# Altium schematic sheet PineconePiWatch-Bottom.SchDoc
size A2
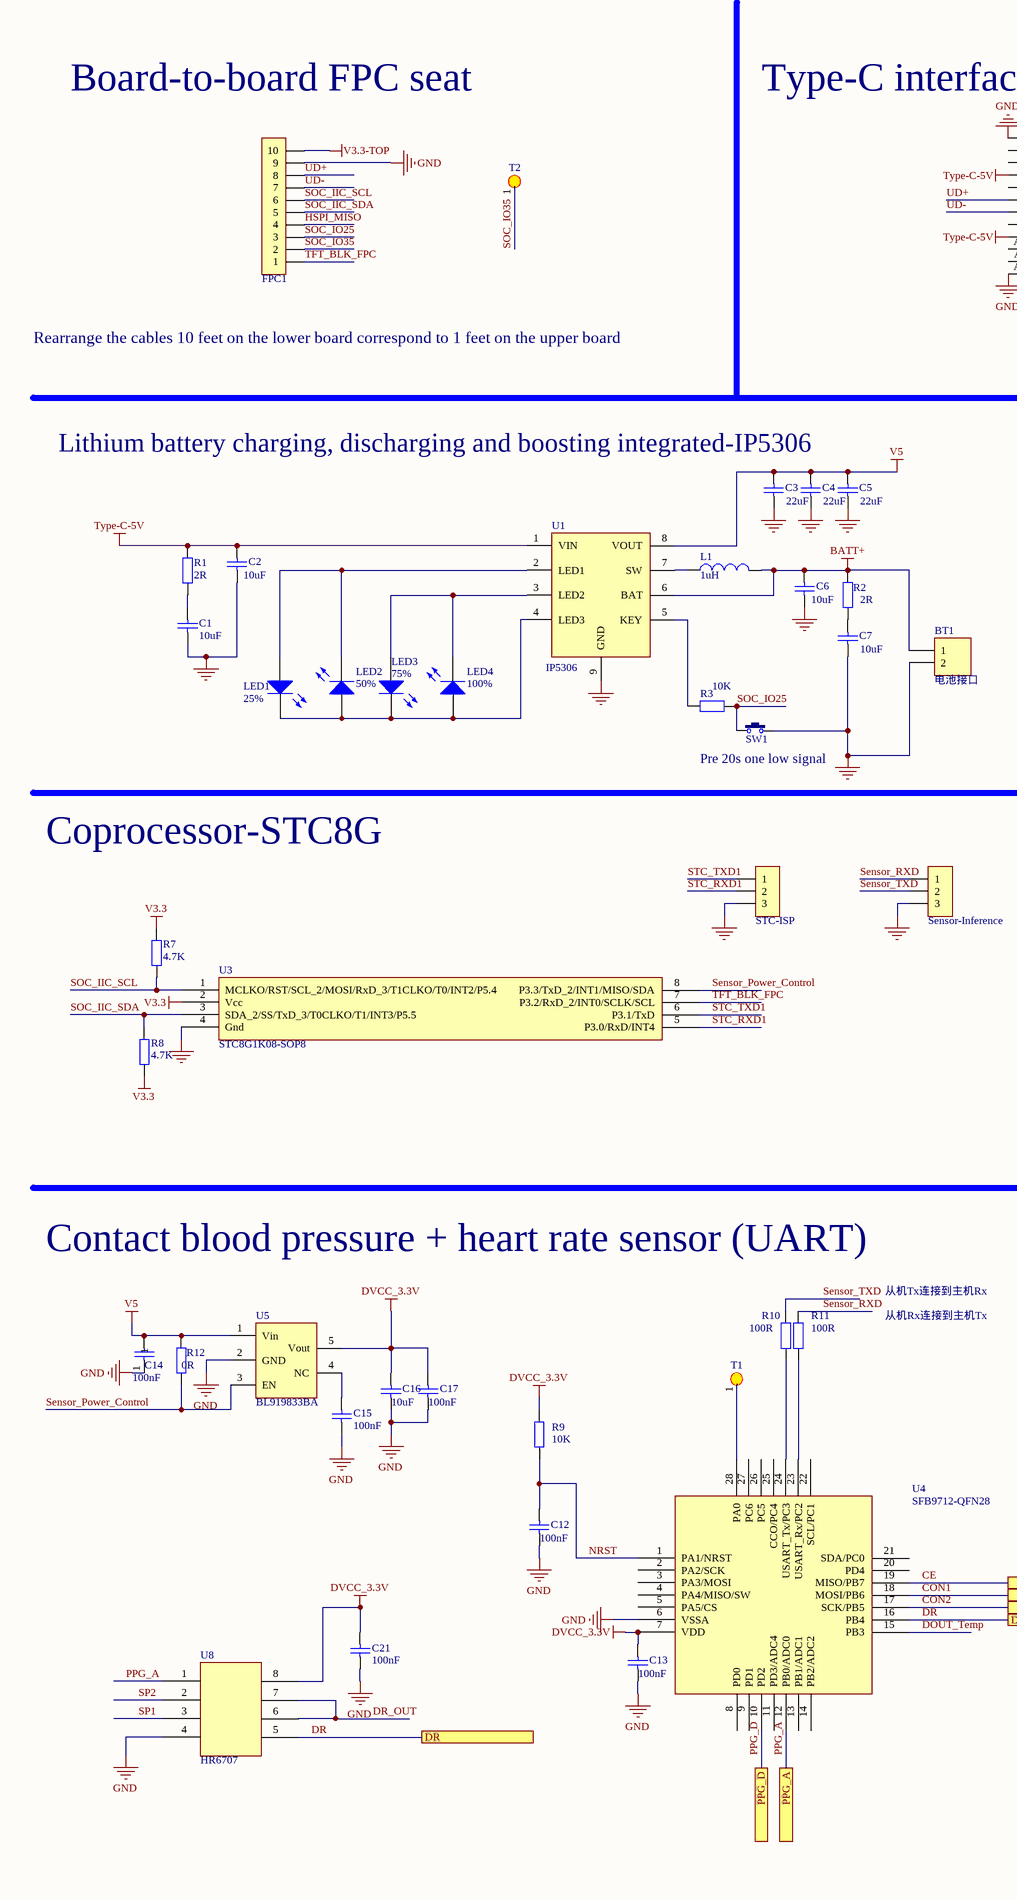
[diagram p0: PineconePiWatch-Bottom.SchDoc, left]
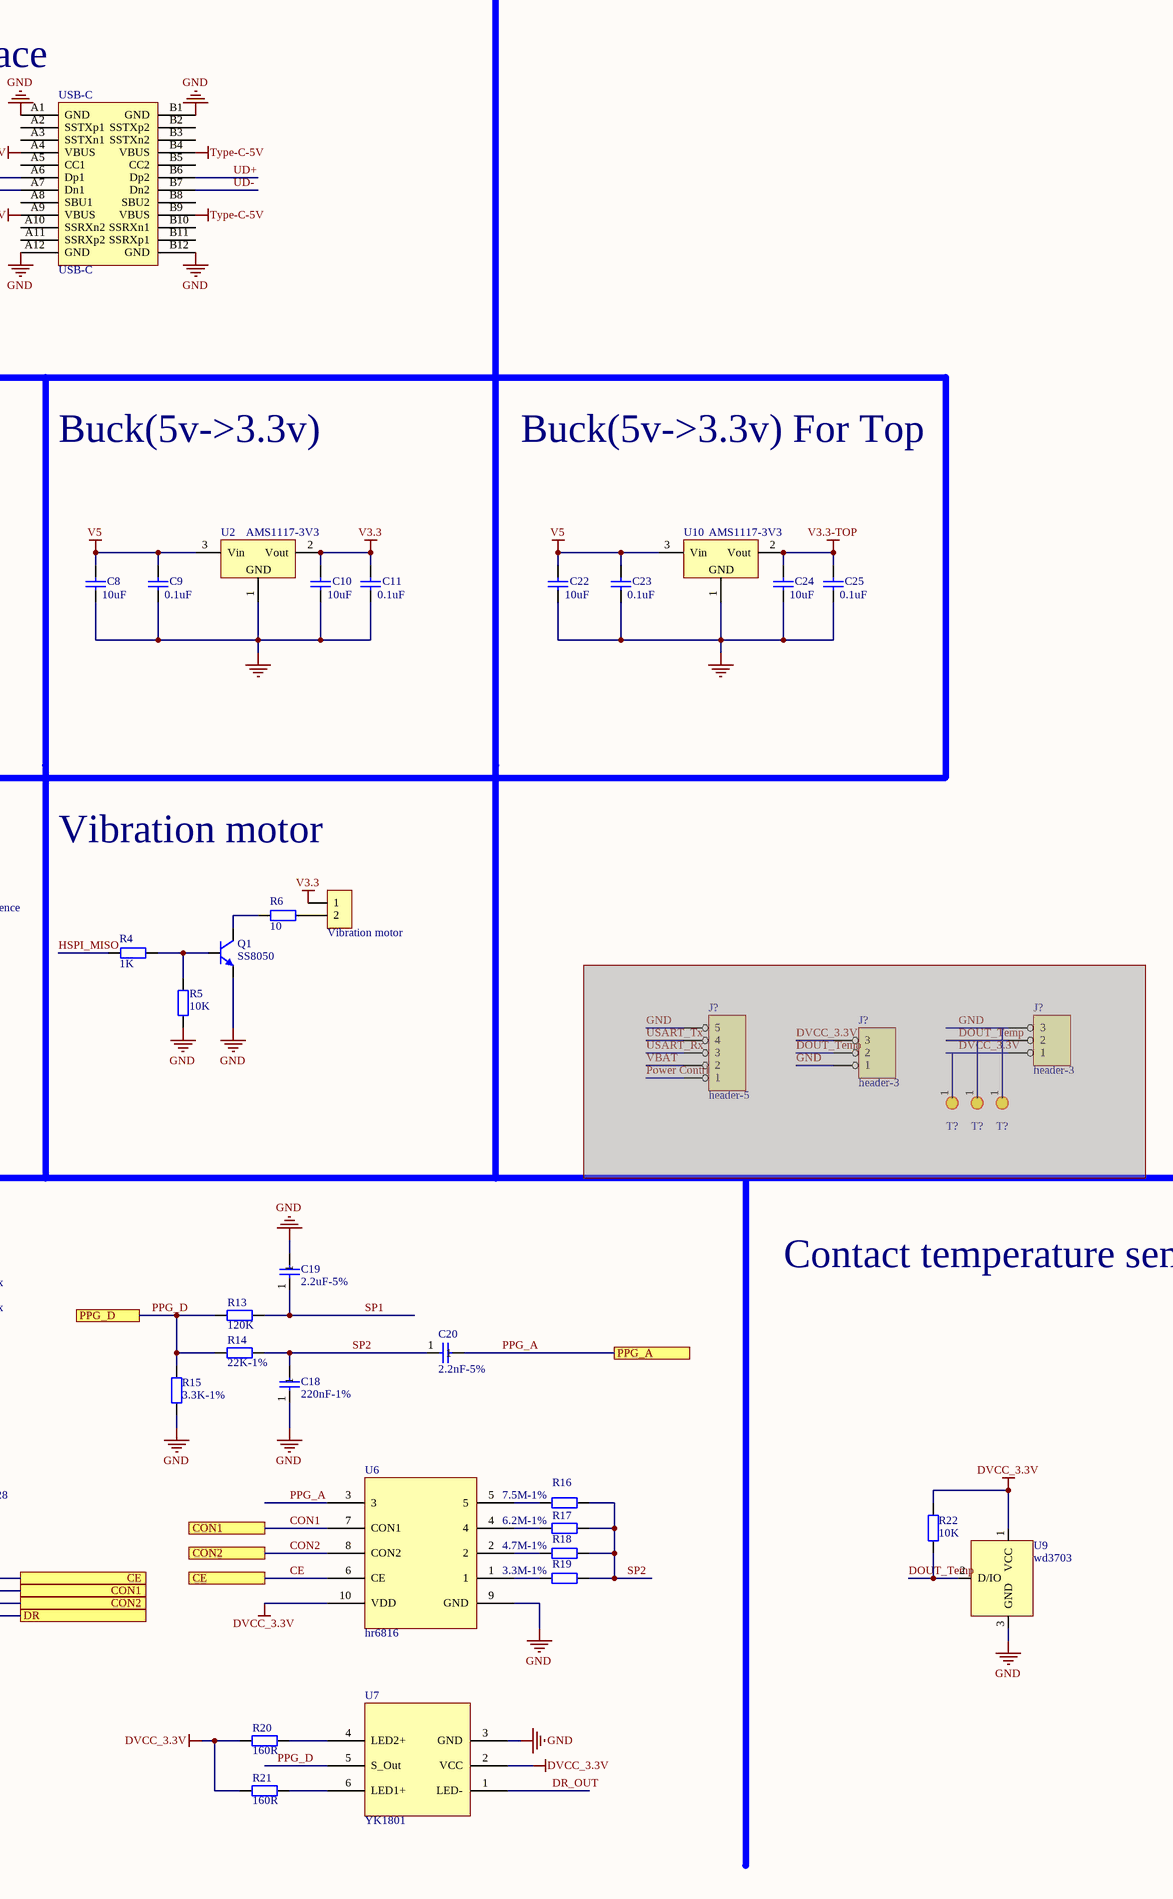
[diagram p1: PineconePiWatch-Bottom.SchDoc, right]

## Parts
(Parts that share a designator on the sheet are numbered #1, #2 ... from top to bottom, then left to right.)
BT1  电池接口  [XH2.54-LI-2P]
C1  10uF  [C 0603_L]
C2  10uF  [C 0603_L]
C3  22uF  [C 0603_L]
C4  22uF  [C 0603_L]
C5  22uF  [C 0603_L]
C6  10uF  [C 0603_L]
C7  10uF  [C 0603_L]
C8  10uF  [C 0603_L]
C9  0.1uF  [C 0603_L]
C10  10uF  [C 0603_L]
C11  0.1uF  [C 0603_L]
C12  100nF  [C 0603_L]
C13  100nF  [C 0603_L]
C14  100nF  [C 0603_L]
C15  100nF  [C 0603_L]
C16  10uF  [C 0603_L]
C17  100nF  [C 0603_L]
C18  value 220nF-1%  [C 0603_L]  (hidden comment: 220nF)
C19  value 2.2uF-5%  [C 0603_L]  (hidden comment: 2.2uF)
C20  value 2.2nF-5%  [C 0603_L]  (hidden comment: 2.2nF)
C21  100nF  [C 0603_L]
C22  10uF  [C 0603_L]
C23  0.1uF  [C 0603_L]
C24  10uF  [C 0603_L]
C25  0.1uF  [C 0603_L]
FPC1  HDR-1X10  [FPC1.0-2H-WS-10P]  (value not drawn)
J?#1  header-3  [header-3]  (masked out: inside a compile mask, not in the netlist)
J?#2  header-3  [header-3]  (masked out: inside a compile mask, not in the netlist)
J?#3  header-5  [CON5]  (masked out: inside a compile mask, not in the netlist)
L1  1uH  [L-SMD-0630]
LED1  25%  [LED 0603R]
LED2  50%  [LED 0603R]
LED3  75%  [LED 0603R]
LED4  100%  [LED 0603R]
Q1  SS8050  [SOT-23]
R1  2R  [R 0603_L]
R2  2R  [R 0603_L]
R3  10K  [R 0603_L]
R4  1K  [R 0603_L]
R5  10K  [R 0603_L]
R6  10  [R 0603_L]
R7  4.7K  [R 0603_L]
R8  4.7K  [R 0603_L]
R9  10K  [R 0603_L]
R10  100R  [C 0603_L]
R11  100R  [C 0603_L]
R12  value 0R  [R 0603-HP_L]  (hidden comment: 0)
R13  120K  [R 0603_L]
R14  value 22K-1%  [R 0603_L]  (hidden comment: 22K)
R15  value 3.3K-1%  [R 0603_L]  (hidden comment: 3.3K)
R16  value 7.5M-1%  [R 0603_L]  (hidden comment: 7.5M)
R17  value 6.2M-1%  [R 0603_L]  (hidden comment: 6.2M)
R18  value 4.7M-1%  [R 0603_L]  (hidden comment: 4.7M)
R19  value 3.3M-1%  [R 0603_L]  (hidden comment: 3.3M)
R20  160R  [R 0603_L]
R21  160R  [R 0603_L]
R22  10K  [R 0603_L]
Sensor-Inference  HDR-1X3  [HDR2.54-LI-3P]  (value not drawn)
STC-ISP  HDR-1X3  [HDR2.54-LI-3P]  (value not drawn)
SW1  3x6x5  [TSW 3*6*4.3-S-W]  (value not drawn)
T1  Test_Point  [TP_1_0MM]  (value not drawn)
T2  Test_Point  [TP_1_0MM]  (value not drawn)
T?#1  Test_Point  [TP_1_0MM]  (value not drawn)  (masked out: inside a compile mask, not in the netlist)
T?#2  Test_Point  [TP_1_0MM]  (value not drawn)  (masked out: inside a compile mask, not in the netlist)
T?#3  Test_Point  [TP_1_0MM]  (value not drawn)  (masked out: inside a compile mask, not in the netlist)
U1  IP5306  [IP5306]
U2  AMS1117-3V3  [SOT223_L]
U3  STC8G1K08-SOP8  [SOP8]
U4  SFB9712-QFN28  [SFB9712]
U5  BL919833BA  [BL9198]
U6  hr6816  [HR6816]
U7  YK1801  [YK1801]
U8  HR6707  [HR6707]
U9  wd3703  [WD3703]
U10  AMS1117-3V3  [SOT223_L]
USB-C  USB-C  [type-c 24p 前插后贴]
Vibration_motor  HDR-1X2  [HDR2.54-LI-2P]  (value not drawn)

## Ports
CE, CON1, CON2, DR, PPG_A, PPG_D

## Nets
BATT+: BT1.1 C6.2 L1.2 R2.1 U1.6(BAT)
DVCC_3.3V: C13.2 C16.2 C17.2 C21.2 R9.1 R20.1 R21.1 R22.2 U4.7(VDD) U5.5(Vout) U6.10(VDD) U7.2(VCC) U8.8 U9.1(VCC)
GND: BT1.2 C1.1 C2.1 C3.1 C4.1 C5.1 C6.1 C7.1 C8.1 C9.1 C10.1 C11.1 C12.1 C13.1 C14.1 C15.1 C16.1 C17.1 C18.1 C19.2 C21.1 C22.1 C23.1 C24.1 C25.1 FPC1.9 Q1.2(E) R5.1 R15.1 Sensor-Inference.3 STC-ISP.3 SW1.2 U1.9(GND) U2.1(GND) U3.4(Gnd) U4.6(VSSA) U5.2(GND) U6.9(GND) U7.3(GND) U8.4 U9.3(GND) U10.1(GND) USB-C.A1(GND) USB-C.A12(GND) USB-C.B1(GND) USB-C.B12(GND)
Type-C-5V: C2.2 R1.2 U1.1(VIN) USB-C.A4(VBUS) USB-C.A9(VBUS) USB-C.B4(VBUS) USB-C.B9(VBUS)
V3.3: C10.2 C11.2 R7.2 R8.1 U2.2(Vout) U3.2(Vcc) Vibration_motor.1
V3.3-TOP: C24.2 C25.2 FPC1.10 U10.2(Vout)
V5: C3.2 C4.2 C5.2 C8.2 C9.2 C14.2 C22.2 C23.2 R12.2 U1.8(VOUT) U2.3(Vin) U5.1(Vin) U10.3(Vin)
CE: U4.19(MISO/PB7) U6.6(CE) ; port CE
CON1: U4.18(MOSI/PB6) U6.7(CON1) ; port CON1
CON2: U4.17(SCK/PB5) U6.8(CON2) ; port CON2
DOUT_Temp: R22.1 U4.15(PB3) U9.2(D/IO)
DR: U4.16(PB4) U8.5 ; port DR
DR_OUT: U7.1(LED-) U8.6 U8.7
HSPI_MISO: FPC1.4 R4.1
NRST: C12.2 R9.2 U4.1(PA1/NRST)
PPG_A: C20.2 U4.12(PB0/ADC0) U6.3 U8.1(PPG_ac) ; port PPG_A
PPG_D: R13.1 R14.1 R15.2 U4.10(PD2) U7.5(S_Out) ; port PPG_D
Sensor_Power_Control: R12.1 U3.8(P3.3/TxD_2/INT1/MISO/SDA) U5.3(EN)
Sensor_RXD: R11.1 Sensor-Inference.1
Sensor_TXD: R10.2 Sensor-Inference.2
SOC_IIC_SCL: FPC1.6 R7.1 U3.1(MCLKO/RST/SCL_2/MOSI/RxD_3/T1CLKO/T0/INT2/P5.4)
SOC_IIC_SDA: FPC1.5 R8.2 U3.3(SDA_2/SS/TxD_3/T0CLKO/T1/INT3/P5.5)
SOC_IO25: FPC1.3 R3.1 SW1.1
SOC_IO35: FPC1.2 T2.1
SP1: C19.1 R13.2 U8.3
SP2: C18.2 C20.1 R14.2 R16.2 R17.2 R18.2 R19.2 U8.2
STC_RXD1: STC-ISP.2 U3.5(P3.0/RxD/INT4)
STC_TXD1: STC-ISP.1 U3.6(P3.1/TxD)
TFT_BLK_FPC: FPC1.1 U3.7(P3.2/RxD_2/INT0/SCLK/SCL)
UD+: FPC1.8 USB-C.A6(Dp1) USB-C.B6(Dp2)
UD-: FPC1.7 USB-C.A7(Dn1) USB-C.B7(Dn2)
NetC1_2: C1.2 R1.1
NetC7_2: C7.2 R2.2
NetC15_2: C15.2 U5.4(NC)
NetL1_1: L1.1 U1.7(SW)
NetLED1_1: LED1.1(A) LED2.2(K) U1.2(LED1)
NetLED1_2: LED1.2(K) LED2.1(A) LED3.2(K) LED4.1(A) U1.4(LED3)
NetLED3_1: LED3.1(A) LED4.2(K) U1.3(LED2)
NetQ1_1: Q1.1(B) R4.2 R5.2
NetQ1_3: Q1.3(C) R6.2
NetR3_2: R3.2 U1.5(KEY)
NetR6_1: R6.1 Vibration_motor.2
NetR10_1: R10.1 U4.24(USART_Tx/PC3)
NetR11_2: R11.2 U4.23(USART_Rx/PC2)
NetR16_1: R16.1 U6.5
NetR17_1: R17.1 U6.4
NetR18_1: R18.1 U6.2
NetR19_1: R19.1 U6.1
NetR20_2: R20.2 U7.4(LED2+)
NetR21_2: R21.2 U7.6(LED1+)
NetT1_1: T1.1 U4.28(PA0)

Not connected (* = marked no-connect by the designer): U4 2(PA2/SCK) 3(PA3/MOSI) 4(PA4/MISO/SW) 5(PA5/CS) 8(PD0) 9(PD1) 11(PD3/ADC4) 13(PB1/ADC1) 14(PB2/ADC2) 20(PD4) 21(SDA/PC0) 22(SCL/PC1) 25(CCO/PC4) 26(PC5) 27(PC6); USB-C A2(SSTXp1) A3(SSTXn1) A5(CC1) A8(SBU1) A10(SSRXn2) A11(SSRXp2) B2(SSTXp2) B3(SSTXn2) B5(CC2) B8(SBU2) B10(SSRXn1) B11(SSRXp1)

## Notes on the sheet
- Board-to-board FPC seat
- (near USB-C) Type-C interface
- Rearrange the cables 10 feet on the lower board correspond to 1 feet on the upper board
- Lithium battery charging, discharging and boosting integrated-IP5306
- Buck(5v->3.3v)
- Buck(5v->3.3v) For Top
- (near SW1) Pre 20s one low signal
- Coprocessor-STC8G
- Vibration motor
- Contact blood pressure + heart rate sensor (UART)
- 从机Tx连接到主机Rx
- Contact temperature sensor (UART)
- 从机Rx连接到主机Tx
- Title
- Size:
- Date:
- File:
- A2
- Number:
- Time:
- Revision:
- Sheet
- of

## Library data of the parts
BT1 = Header 2H: Header, 2-Pin, Right Angle; LatestRevisionDate: 17-Jul-2002; LatestRevisionNote: Re-released for DXP Platform.; Publisher: Altium Limited
C1-C11 C15 C21-C25 = Cap: Capacitor; Published: 8-Jun-2000; LatestRevisionDate: 17-Jul-2002; LatestRevisionNote: Re-released for DXP Platform.; PackageReference: RAD-0.3; Publisher: Altium Limited
  C1: Value: 10uF
  C15 C21: Value: 100nF
C12 C13 C16 C17 = Cap: Capacitor; Value: 103; Published: 8-Jun-2000; LatestRevisionDate: 17-Jul-2002; LatestRevisionNote: Re-released for DXP Platform.; PackageReference: RAD-0.3; Publisher: Altium Limited
C14 = Cap_1: Capacitor; Value: 22uF-5%; Published: 8-Jun-2000; LatestRevisionDate: 17-Jul-2002; LatestRevisionNote: Re-released for DXP Platform.; PackageReference: RAD-0.3; Publisher: Altium Limited
C18-C20 = Cap_1: Capacitor; Published: 8-Jun-2000; LatestRevisionDate: 17-Jul-2002; LatestRevisionNote: Re-released for DXP Platform.; PackageReference: RAD-0.3; Publisher: Altium Limited
FPC1 = Header 10: 10P接插件; 版权归属: 封装库来自淘宝 ID：黄晶宝石; BOM名称: 10P接插件; 学习资源: https://shop463601444.taobao.com
L1 = Inductor: Code_IEC: 1005; Published: 8-Jun-2000; LatestRevisionDate: 29-May-2009; LatestRevisionNote: IPC-7351 Footprint Added.; PackageReference: 0402-A; Publisher: Altium Limited; PackageDescription: Chip Inductor; Code_JEITA: 0402
LED1-LED4 = LED0: Typical INFRARED GaAs LED; Published: 8-Jun-2000; LatestRevisionDate: 08-Jul-2005; LatestRevisionNote: Mech Layer 1 removed.; PackageReference: LED-0; Publisher: Altium Limited
Q1 = 8050-SMD: 高频放大-NPN型; 版权归属: 封装库来自淘宝 ID：黄晶宝石; 属性: 40V 1.5A 1W 100MHZ; BOM名称: 高频放大-NPN型; 联系售后: https://shop463601444.taobao.com
R1-R3 R10-R22 = Res2: Resistor; Published: 8-Jun-2000; LatestRevisionDate: 17-Jul-2002; LatestRevisionNote: Re-released for DXP Platform.; PackageReference: AXIAL-0.4; Publisher: Altium Limited
  R10 R11: Value: 100R
  R13: Value: 120K
  R20 R21: Value: 160R
  R22: Value: 10K
R4-R8 = R: 贴片电阻; 版权归属: 来自淘宝 ID：黄晶宝石; 封装库来自淘宝卖家 ID：黄晶宝石: 其他店铺购入均为盗版，不享受售后技术支持服务，请立即申请退款; BOM名称: 贴片电阻; 联系售后: https://shop463601444.taobao.com
R9 = Res2: Resistor; Value: 44.2K; Published: 8-Jun-2000; LatestRevisionDate: 17-Jul-2002; LatestRevisionNote: Re-released for DXP Platform.; PackageReference: AXIAL-0.4; Publisher: Altium Limited
Sensor-Inference STC-ISP = Header 3: 3P接插件; 联系售后: 封装库来自淘宝 ID：黄晶宝石; BOM名称: 3P接插件; 学习资源: https://shop463601444.taobao.com
SW1 = TSW 3x6: 3x6轻触开关; 版权归属: 源创客; BOM名称: 3x6轻触开关; 学习资源: www.ooocke.com
T1 T2 T?#1-T?#3 = TP
U2 U10 = AMS1117: 三端稳压芯片; BOM名称: 稳压芯片; 淘宝ID: 封装库来自淘宝 ID：黄晶宝石; 欢迎光临淘宝店铺: https://shop463601444.taobao.com
USB-C = USB-C/S: USB-C型母接口; 学习资源: 封装库来自淘宝卖家 ID：黄晶宝石; BOM名称: USB-C型母接口; 封装库来自淘宝 ID：黄晶宝石: https://shop463601444.taobao.com
Vibration_motor = Header 2: 2P接插件; 版权归属: 封装库来自淘宝 ID：黄晶宝石; 技术支持，联系售后: 封装库来自淘宝卖家 ID：黄晶宝石; BOM名称: 2P接插件; 联系售后: https://shop463601444.taobao.com